# Altium schematic sheet CanhBaoChay.SchDoc
size A4
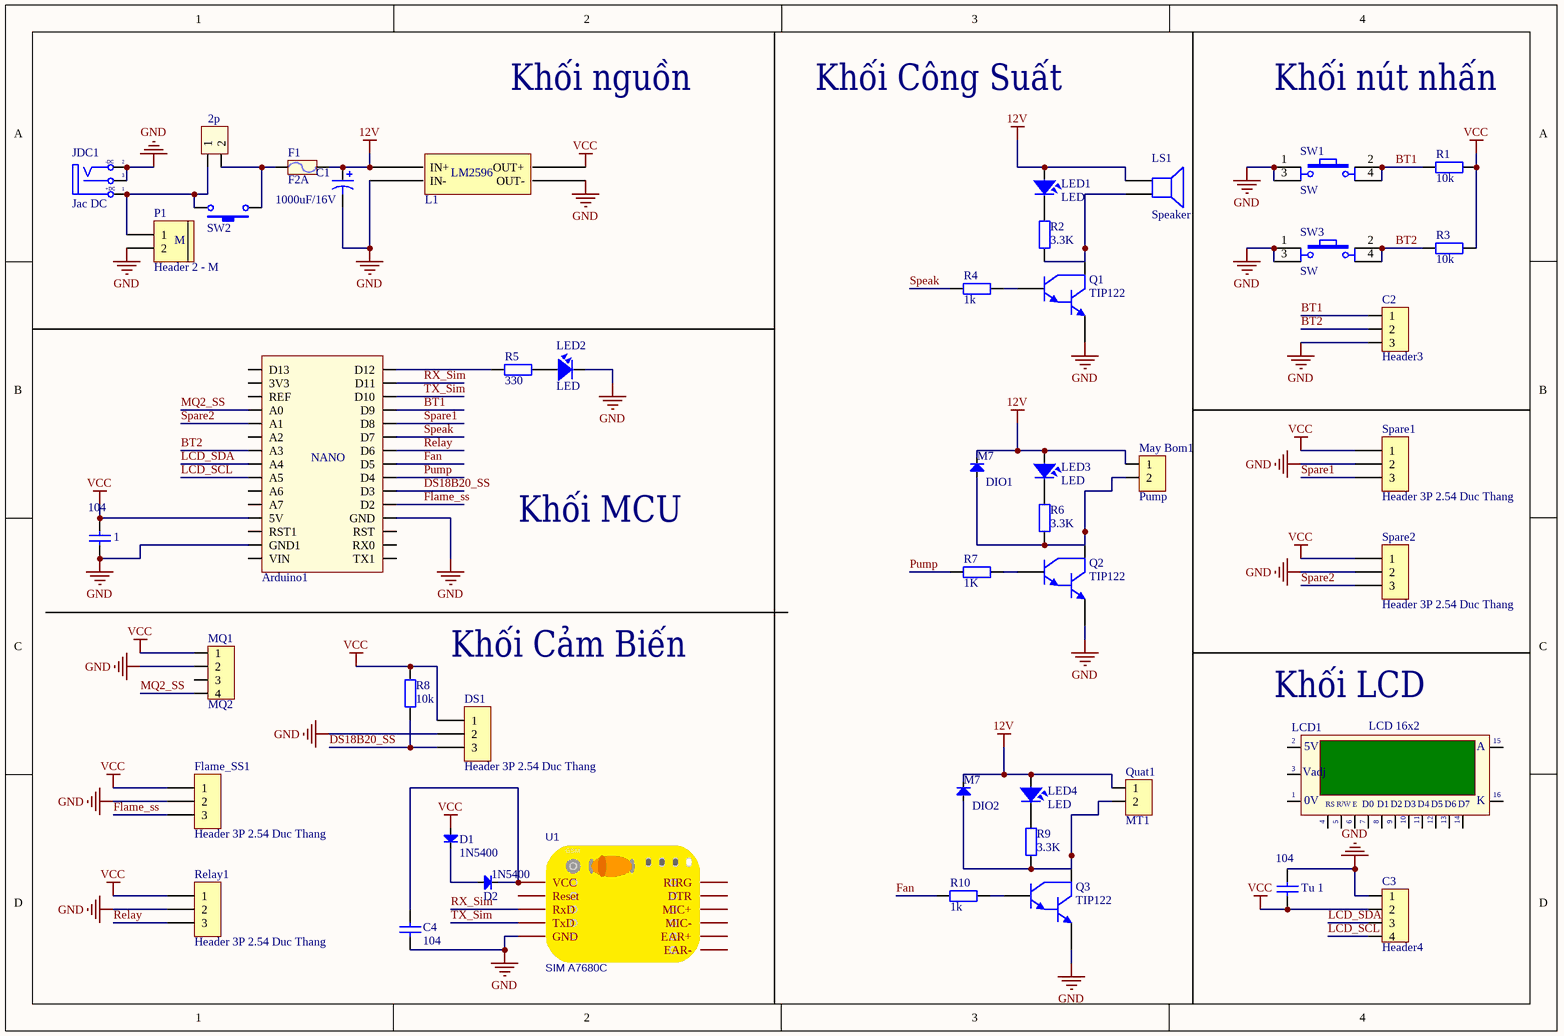
[diagram p0: CanhBaoChay.SchDoc]

## Parts
1  104  [C0805]
Arduino1  Arduino Nano  [Arduino Nano]  (value not drawn)
C1  1000uF/16V  [C10mm]
C2  Header3  [Header3]
C3  Header4  [XH2.54M-4]
C4  104  [C0805]
D1  1N5400  [DIO-5A]
D2  1N5400  [DIO-5A]
DIO1  M7  [DIO-SMD-106]
DIO2  M7  [DIO-SMD-106]
DS1  Header 3P 2.54 Duc Thang  [Header 3P DC 2.54]
F1  F2A  [Fuse]
Flame_SS1  Header 3P 2.54 Duc Thang  [Header 3P DC 2.54]
H1  2p  [XH2.54M-2]
JDC1  Jac DC  [DC-IN]
L1  BUCK_LM2596  [BUCK_LM2596]  (value not drawn)
LCD1  LCD 16x2  [LCD16X2N]
LED1  LED  [LED-5 GRe]
LED2  LED  [LED-5 GRe]
LED3  LED  [LED-5 GRe]
LED4  LED  [LED-5 GRe]
LS1  Speaker  [SPEAKER]
May_Bom1  Pump  [Header 2P DC 2.54]
MQ1  MQ2  [Header 4P DC 2.54]
P1  Header 2 - M  [Medium - Header 2]
Q1  TIP122  [QTO-220]
Q2  TIP122  [QTO-220]
Q3  TIP122  [QTO-220]
Quat1  MT1  [Header 2P DC 2.54]
R1  10k  [RES-SMD-1206]
R2  3.3K  [RES-SMD-1206]
R3  10k  [RES-SMD-1206]
R4  1k  [RES-SMD-1206]
R5  330  [RES-SMD-1206]
R6  3.3K  [RES-SMD-1206]
R7  1K  [RES-SMD-1206]
R8  10k  [RES-SMD-1206]
R9  3.3K  [RES-SMD-1206]
R10  1k  [RES-SMD-1206]
Relay1  Header 3P 2.54 Duc Thang  [XH2.54M-3]
Spare1  Header 3P 2.54 Duc Thang  [XH2.54M-3]
Spare2  Header 3P 2.54 Duc Thang  [XH2.54M-3]
SW1  SW  [SW4]
SW2  KCD01-11_SWITCH  [KCD01-11]  (value not drawn)
SW3  SW  [SW4]
Tu_1  104  [C0805]
U1  SIM A7680C  [SIM800L MODULE]

## Nets
12V: C1.1 DIO1.2(K) DIO2.2(K) F1.2 L1.1(IN+) LED1.1 LED3.1 LED4.1 LS1.1 May_Bom1.1 Quat1.1
GND: 1.1 Arduino1.GND Arduino1.GND1 C1.2 C2.3 C3.1 C4.2 DS1.2 Flame_SS1.2 JDC1.2(TN) JDC1.3(S) L1.2(IN-) L1.3(OUT-) LED2.2 MQ1.2 P1.2 Q1.3(E) Q2.3(E) Q3.3(E) Relay1.2 Spare1.2 Spare2.2 SW1.1 SW1.3 SW3.1 SW3.3 Tu_1.2 U1.5(GND)
VCC: 1.2 Arduino1.5V C3.2 D1.1(A) DS1.1 Flame_SS1.1 L1.4(OUT+) MQ1.1 R1.2 R3.2 R8.1 Relay1.1 Spare1.1 Spare2.1 Tu_1.1
BT1: Arduino1.D9 C2.1 R1.1 SW1.2 SW1.4
BT2: Arduino1.A3 C2.2 R3.1 SW3.2 SW3.4
DS18B20_SS: Arduino1.D3 DS1.3 R8.2
Fan: Arduino1.D5 R10.2
Flame_ss: Arduino1.D2 Flame_SS1.3
LCD_SCL: Arduino1.A5 C3.4
LCD_SDA: Arduino1.A4 C3.3
MQ2_SS: Arduino1.A0 MQ1.4
Pump: Arduino1.D4 R7.2
Relay: Arduino1.D6 Relay1.3
RX_Sim: Arduino1.D11 U1.3(RxD)
Spare1: Arduino1.D8 Spare1.3
Spare2: Arduino1.A1 Spare2.3
Speak: Arduino1.D7 R4.2
TX_Sim: Arduino1.D10 U1.4(TxD)
NetArduino1_D12: Arduino1.D12 R5.2
NetC4_1: C4.1 D2.2(K) U1.1(VCC)
NetD1_2: D1.2(K) D2.1(A)
NetDIO1_1: DIO1.1(A) May_Bom1.2 Q2.2(C) R6.2
NetDIO2_1: DIO2.1(A) Q3.2(C) Quat1.2 R9.2
NetF1_1: F1.1 H1.2 SW2.1
NetH1_1: H1.1 JDC1.1(T) P1.1 SW2.2
NetLED1_2: LED1.2 R2.1
NetLED2_1: LED2.1 R5.1
NetLED3_2: LED3.2 R6.1
NetLED4_2: LED4.2 R9.1
NetLS1_2: LS1.2 Q1.2(C) R2.2
NetQ1_1: Q1.1(B) R4.1
NetQ2_1: Q2.1(B) R7.1
NetQ3_1: Q3.1(B) R10.1

Not connected (* = marked no-connect by the designer): Arduino1 3V3 A2 A6 A7 D13 REF RST RST1 RX0 TX1 VIN; LCD1 1(GND) 2(VDD) 3(VAdj) 4(RS) 5(R/~{W}) 6(~{EN}) 7(D0) 8(D1) 9(D2) 10(D3) 11(D4) 12(D5) 13(D6) 14(D7) 15(A) 16(K); MQ1 3; U1 2(Reset) 6(RIRG) 7(DTR) 8(MIC+) 9(MIC-) 10(EAR+) 11(EAR-)

## Notes on the sheet
- Khối nguồn
- Khối Công Suất
- Khối nút nhấn
- Khối MCU
- Khối Cảm Biến
- (near LCD1) Khối LCD
- (in symbol Arduino Nano) NANO
- (in symbol BUCK_LM2596) LM2596
- (in symbol DCIN) -DC; +DC
- (in symbol Header 2 - M) M
- (in symbol LCD) 5V; Vadj; |; 0V; R/W; E
- (in symbol SIM800L) GSM

## Library data of the parts
1 C4 Tu_1 = CapSMD: Capacitor; Value: 33p; Published: 8-Jun-2000; LatestRevisionDate: 17-Jul-2002; LatestRevisionNote: Re-released for DXP Platform.; PackageReference: RAD-0.3; Publisher: Altium Limited
Arduino1 = Arduino Nano: Value: Cau 1A
C1 = Cap Pol 12mm: Polarized Capacitor (Axial); Published: 8-Jun-2000; LatestRevisionDate: 17-Jul-2002; LatestRevisionNote: Re-released for DXP Platform.; PackageReference: POLAR0.8; Publisher: Altium Limited
C2 = Header3: Header IDC, 3 x 1 Pin Vertical 2.54mm Pitch (Non-Boxed, Male); Manufacturer: W¨¹rth Elektronik eiSos GmbH; partNo: 613002143121; ComponentLink1 Description: Manufacturer; ComponentLink2 Description: Datasheet; NoPins: 02; Created Date: 29 March 2013; ComponentLink1URL: http://www.we-online.com; ComponentLink2URL: http://katalog.we-online.de/em/datasheet/6130xx143121.pdf; Created by: Karrer Zheng
C3 MQ1 = Header4: Header IDC, 4 x 1 Pin Vertical 2.54mm Pitch (Non-Boxed, Male); Manufacturer: W¨¹rth Elektronik eiSos GmbH; partNo: 613002143121; ComponentLink1 Description: Manufacturer; ComponentLink2 Description: Datasheet; NoPins: 02; Created Date: 29 March 2013; ComponentLink1URL: http://www.we-online.com; ComponentLink2URL: http://katalog.we-online.de/em/datasheet/6130xx143121.pdf; Created by: Karrer Zheng
D1 D2 = Diode: Default Diode; Code - JEDEC: DO-214-AB; Value: 1N5007; Published: 8-Jun-2000; Revision: July-2002: Re-released for DXP Platform.; Publisher: Altium Limited
DIO1 DIO2 = Diode SMD: Default Diode; Code - JEDEC: DO-214-AB; Value: 1N5007; Published: 8-Jun-2000; Revision: July-2002: Re-released for DXP Platform.; Publisher: Altium Limited
DS1 Flame_SS1 Relay1 Spare1 Spare2 = Header 3P 2.54 Duc Thang: Cắm; Ten_Linh_Kien: Header 3P XH2.54-3P Đực Thẳng; Don_Vi: Con; Ma_Hang: MH001292; Chung_Loai: Cắm
F1 = Fuse: Designed by: VanDungEvn; Value: Fuse
H1 = Header 2P 2.54 Duc Thang: Cắm; Ten_Linh_Kien: Header 2P XH2.54-2P Đực Thẳng; Don_Vi: Con; Ma_Hang: MH001283; Chung_Loai: Cắm
JDC1 = DCIN: Jac DC input; Value: Jac DC
LCD1 = LCD
LED1-LED4 = LED: LED Single colour Green and Red; Value: LED 3 ly Single Colour
LS1 = Speaker: Loudspeaker; Published: 24-Mar-1999; LatestRevisionDate: 17-Jul-2002; LatestRevisionNote: Re-released for DXP Platform.; PackageReference: PIN2; Publisher: Altium Limited
May_Bom1 Quat1 = Header2: Header IDC, 2 x 1 Pin Vertical 2.54mm Pitch (Non-Boxed, Male); Manufacturer: W¨¹rth Elektronik eiSos GmbH; partNo: 613002143121; ComponentLink1 Description: Manufacturer; ComponentLink2 Description: Datasheet; NoPins: 02; Created Date: 29 March 2013; ComponentLink1URL: http://www.we-online.com; ComponentLink2URL: http://katalog.we-online.de/em/datasheet/6130xx143121.pdf; Created by: Karrer Zheng
P1 = Header 2 - M: Header, 2-Pin, Medium; LatestRevisionDate: 17-Jul-2002; LatestRevisionNote: Re-released for DXP Platform.; Publisher: Altium Limited
Q1-Q3 = TIP122: Darlington Silicon Power NPN Transistor, 8 Amp, 100 Volts and 65 Watts
R1-R10 = R0805: Resistor SMD 0805; Published: 8-Jun-2000; LatestRevisionDate: 17-Jul-2002; LatestRevisionNote: Re-released for DXP Platform.; PackageReference: AXIAL-0.4; Publisher: Altium Limited
SW1 SW3 = SW4: Switch button 4 pin; Value: Button chip 4 pin
SW2 = KCD01-11_SWITCH: Nut Nhan 2 Chan SMD 3x6x2.5; Ma_Hang: MH001036; Ten: Nút Nhấn 2 Chân 3x6x2.5MM SMD
U1 = SIM800L: sourceId: ega4lDVPJ; Contributor: trigui; timeStamp: 1475502242; BOM_Supplier Part: B01DLIJM2E; BOM_Supplier: Amazon; spicePre: U